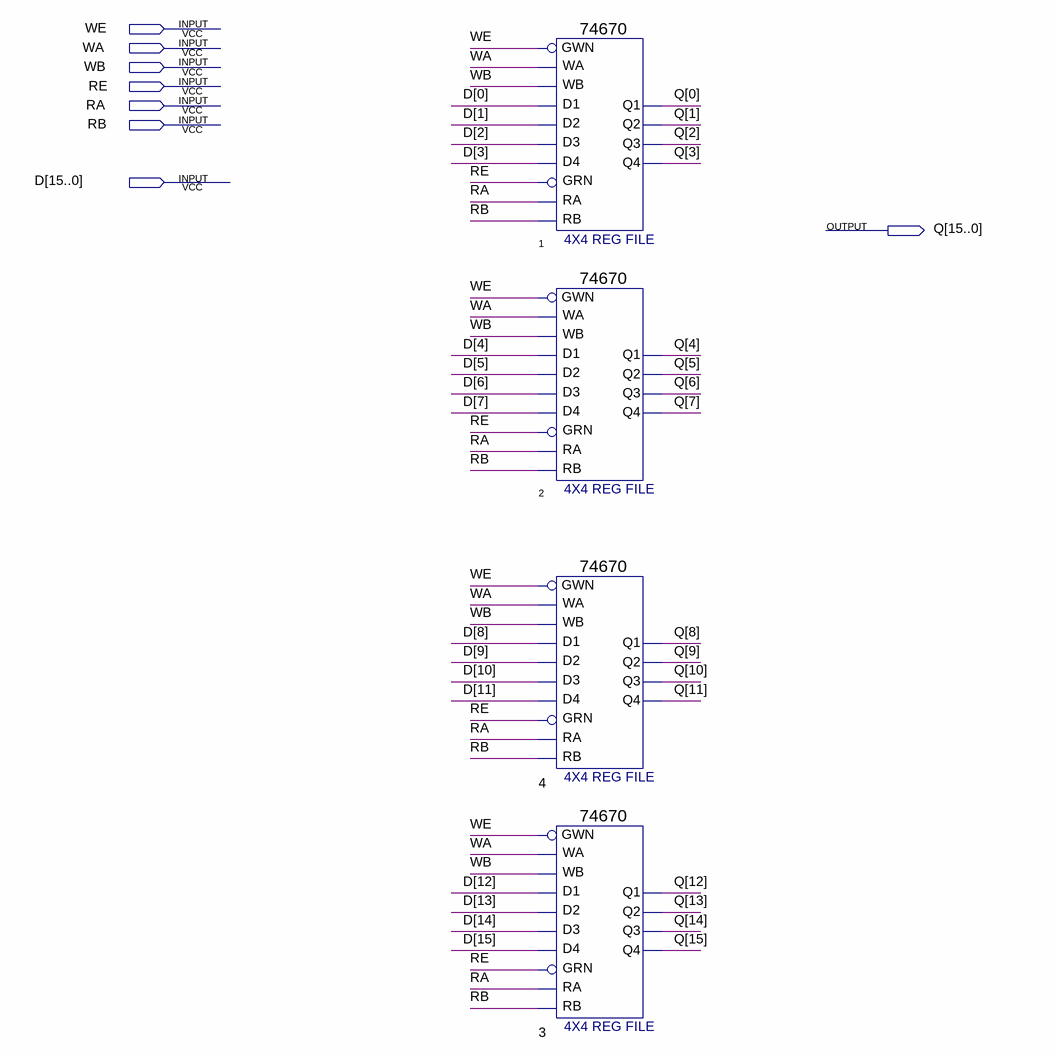
[diagram p0: schematic sheet]
// Quartus schematic 6702.bdf as structural Verilog: 4 symbols, 8 pins
module \6702  (
  input  WE,
  input  WA,
  input  WB,
  input  RE,
  input  RA,
  input  RB,
  input  [15:0] D,
  output [15:0] Q
);

  \74670  u_1 (
    .WA(WA), .WB(WB), .D1(D[0]), .D2(D[1]), .D3(D[2]), .D4(D[3]), .GRN(RE), .RA(RA), .RB(RB), .GWN(WE),
    .Q4(Q[3]), .Q3(Q[2]), .Q2(Q[1]), .Q1(Q[0]));
  \74670  u_2 (
    .WA(WA), .WB(WB), .D1(D[4]), .D2(D[5]), .D3(D[6]), .D4(D[7]), .GRN(RE), .RA(RA), .RB(RB), .GWN(WE),
    .Q4(Q[7]), .Q3(Q[6]), .Q2(Q[5]), .Q1(Q[4]));
  \74670  u_4 (
    .WA(WA), .WB(WB), .D1(D[8]), .D2(D[9]), .D3(D[10]), .D4(D[11]), .GRN(RE), .RA(RA), .RB(RB), .GWN(WE),
    .Q4(Q[11]), .Q3(Q[10]), .Q2(Q[9]), .Q1(Q[8]));
  \74670  u_3 (
    .WA(WA), .WB(WB), .D1(D[12]), .D2(D[13]), .D3(D[14]), .D4(D[15]), .GRN(RE), .RA(RA), .RB(RB), .GWN(WE),
    .Q4(Q[15]), .Q3(Q[14]), .Q2(Q[13]), .Q1(Q[12]));
endmodule
